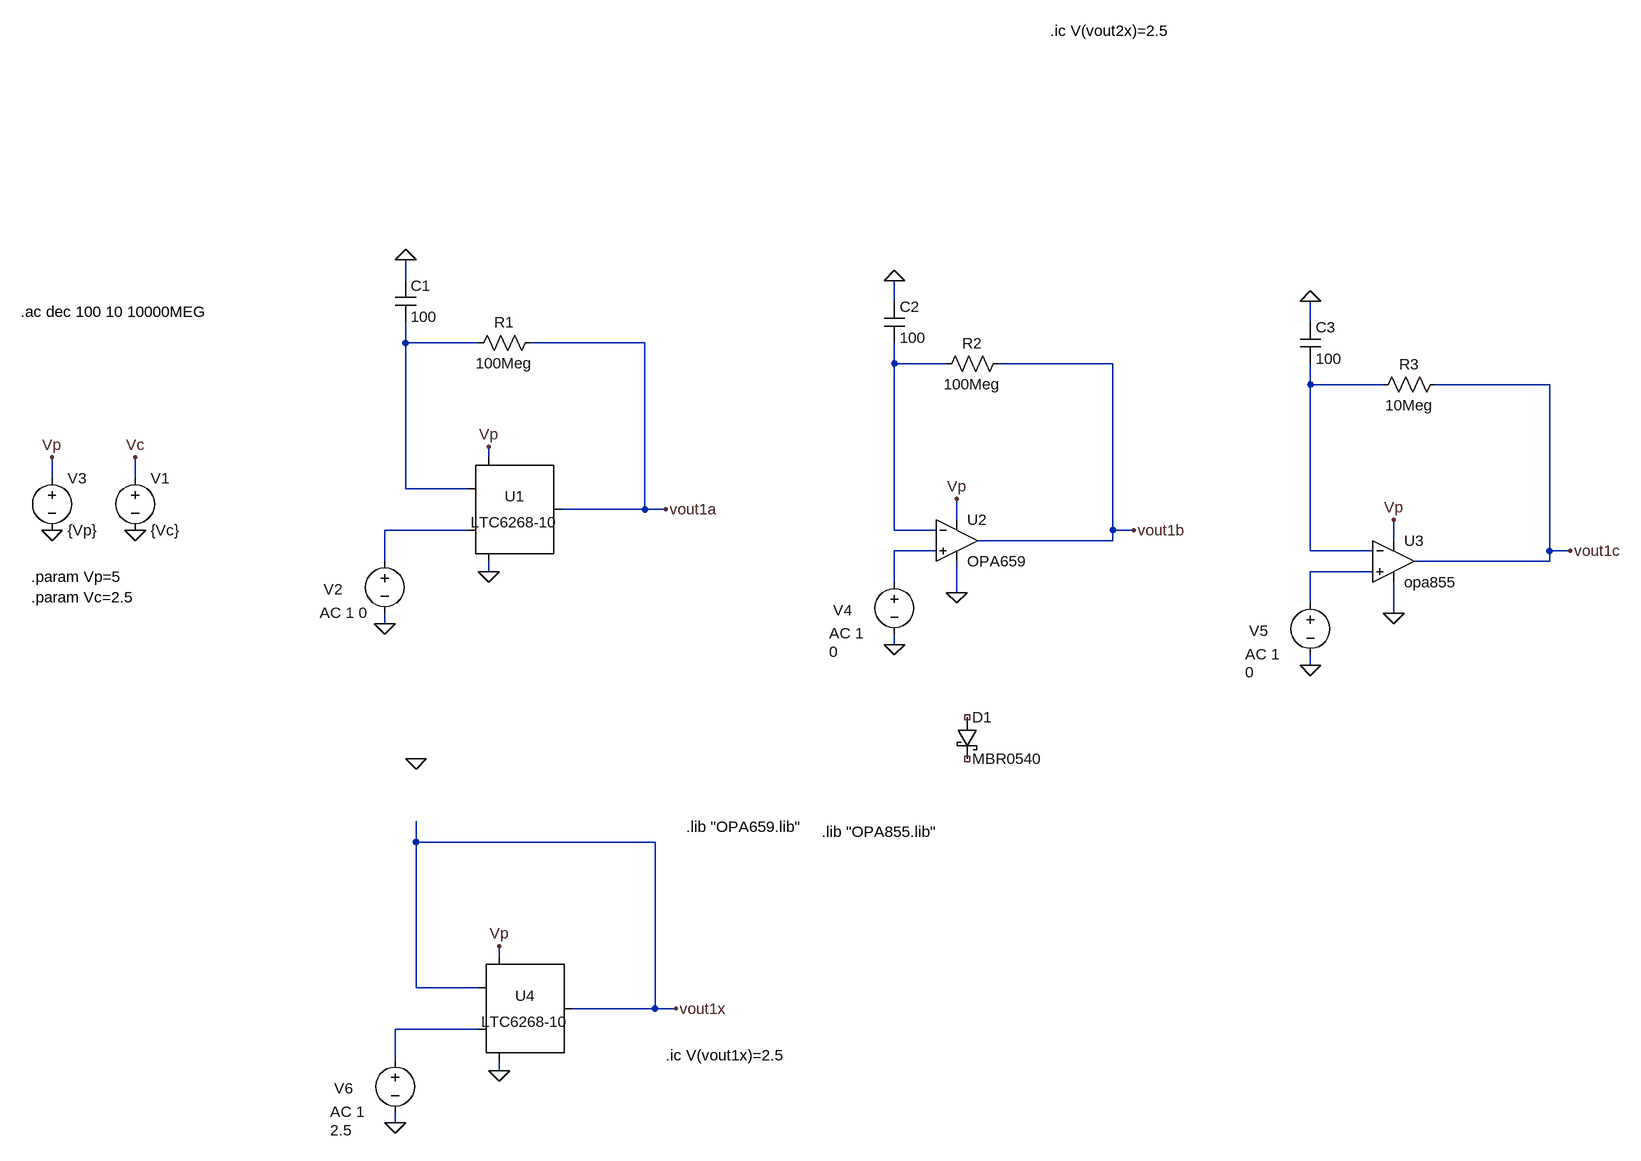
[diagram p0: schematic 3stagecompensator_localloopgainchecks_20220221 -1.asc]
3stagecompensator_localloopgainchecks_20220221 -1.asc, the LTspice schematic file:
Version 4
SHEET 1 6016 2820
WIRE -448 -304 -448 -336
WIRE 304 -272 304 -304
WIRE 944 -240 944 -272
WIRE -448 -208 -448 -240
WIRE -336 -208 -448 -208
WIRE -80 -208 -256 -208
WIRE 304 -176 304 -208
WIRE 384 -176 304 -176
WIRE 640 -176 464 -176
WIRE 944 -144 944 -176
WIRE 1056 -144 944 -144
WIRE 1312 -144 1136 -144
WIRE -320 -32 -320 -48
WIRE -992 0 -992 -32
WIRE -864 0 -864 -32
WIRE -448 16 -448 -208
WIRE -352 16 -448 16
WIRE -80 48 -80 -208
WIRE -80 48 -208 48
WIRE -48 48 -80 48
WIRE 400 64 400 32
WIRE -352 80 -480 80
WIRE 304 80 304 -176
WIRE 368 80 304 80
WIRE 640 80 640 -176
WIRE 672 80 640 80
WIRE 640 96 640 80
WIRE 640 96 432 96
WIRE 1072 96 1072 64
WIRE 368 112 304 112
WIRE 944 112 944 -144
WIRE 1040 112 944 112
WIRE 1312 112 1312 -144
WIRE 1344 112 1312 112
WIRE -480 128 -480 80
WIRE 1312 128 1312 112
WIRE 1312 128 1104 128
WIRE -320 144 -320 128
WIRE 1040 144 944 144
WIRE 304 160 304 112
WIRE 400 176 400 128
WIRE 944 192 944 144
WIRE 1072 208 1072 160
WIRE -480 224 -480 208
WIRE 304 256 304 240
WIRE 944 288 944 272
WIRE -432 560 -432 528
WIRE -64 560 -432 560
WIRE -304 736 -304 720
WIRE -432 784 -432 560
WIRE -336 784 -432 784
WIRE -64 816 -64 560
WIRE -64 816 -192 816
WIRE -32 816 -64 816
WIRE -336 848 -464 848
WIRE -464 896 -464 848
WIRE -304 912 -304 896
WIRE -464 992 -464 976
FLAG -320 144 0
FLAG -992 80 0
FLAG -48 48 vout1a
FLAG -992 -32 Vp
FLAG -864 80 0
FLAG -864 -32 Vc
FLAG -320 -48 Vp
FLAG -480 224 0
FLAG -448 -336 0
FLAG 400 176 0
FLAG 672 80 vout1b
FLAG 400 32 Vp
FLAG 304 256 0
FLAG 304 -304 0
FLAG 1072 208 0
FLAG 1344 112 vout1c
FLAG 1072 64 Vp
FLAG 944 288 0
FLAG 944 -272 0
FLAG -304 912 0
FLAG -32 816 vout1x
FLAG -304 720 Vp
FLAG -464 992 0
FLAG -432 432 0
SYMBOL Opamps\\LTC6268-10 -320 48 R0
SYMATTR InstName U1
SYMBOL voltage -992 -16 R0
WINDOW 123 0 0 Left 2
WINDOW 39 0 0 Left 2
SYMATTR InstName V3
SYMATTR Value {Vp}
SYMBOL voltage -864 -16 R0
WINDOW 123 0 0 Left 2
WINDOW 39 0 0 Left 2
SYMATTR InstName V1
SYMATTR Value {Vc}
SYMBOL voltage -480 112 R0
WINDOW 0 -94 59 Left 2
WINDOW 123 -100 95 Left 2
WINDOW 39 0 0 Left 0
WINDOW 3 -100 123 Left 2
SYMATTR InstName V2
SYMATTR Value2 AC 1 0
SYMATTR Value ""
SYMBOL res -240 -224 R90
WINDOW 0 0 56 VBottom 2
WINDOW 3 32 56 VTop 2
SYMATTR InstName R1
SYMATTR Value 100Meg
SYMBOL cap -464 -304 R0
SYMATTR InstName C1
SYMATTR Value 100
SYMBOL voltage 304 144 R0
WINDOW 0 -94 59 Left 2
WINDOW 123 -100 95 Left 2
WINDOW 39 0 0 Left 0
WINDOW 3 -100 123 Left 2
SYMATTR InstName V4
SYMATTR Value2 AC 1
SYMATTR Value 0
SYMBOL res 480 -192 R90
WINDOW 0 0 56 VBottom 2
WINDOW 3 32 56 VTop 2
SYMATTR InstName R2
SYMATTR Value 100Meg
SYMBOL cap 288 -272 R0
SYMATTR InstName C2
SYMATTR Value 100
SYMBOL voltage 944 176 R0
WINDOW 0 -94 59 Left 2
WINDOW 123 -100 95 Left 2
WINDOW 39 0 0 Left 0
WINDOW 3 -100 123 Left 2
SYMATTR InstName V5
SYMATTR Value2 AC 1
SYMATTR Value 0
SYMBOL res 1152 -160 R90
WINDOW 0 0 56 VBottom 2
WINDOW 3 32 56 VTop 2
SYMATTR InstName R3
SYMATTR Value 10Meg
SYMBOL cap 928 -240 R0
SYMATTR InstName C3
SYMATTR Value 100
SYMBOL OPA659 400 32 R0
SYMATTR InstName U2
SYMBOL opa855 1072 64 R0
SYMATTR InstName U3
SYMBOL Opamps\\LTC6268-10 -304 816 R0
SYMATTR InstName U4
SYMBOL voltage -464 880 R0
WINDOW 0 -94 59 Left 2
WINDOW 123 -100 95 Left 2
WINDOW 39 0 0 Left 0
WINDOW 3 -100 123 Left 2
SYMATTR InstName V6
SYMATTR Value2 AC 1
SYMATTR Value 2.5
SYMBOL schottky 400 368 R0
SYMATTR InstName D1
SYMATTR Value MBR0540
SYMATTR Description Diode
SYMATTR Type diode
TEXT -1040 -256 Left 2 !.ac dec 100 10 10000MEG
TEXT -1024 152 Left 2 !.param Vp=5\n.param Vc=2.5
TEXT 544 -688 Left 2 !.ic V(vout2x)=2.5
TEXT 192 544 Left 2 !.lib "OPA855.lib"
TEXT -16 536 Left 2 !.lib "OPA659.lib"
TEXT -48 888 Left 2 !.ic V(vout1x)=2.5

The netlist it stands for:
* 3stagecompensator_localloopgainchecks_20220221 -1.asc
XU1 N004 N001 vout1a Vp 0 NC_01 LTC6268-10
V3 Vp 0 {Vp}
V1 Vc 0 {Vc}
V2 N004 0 AC 1 0
R1 vout1a N001 100Meg
C1 0 N001 100
V4 N005 0 0 AC 1
R2 vout1b N002 100Meg
C2 0 N002 100
V5 N006 0 0 AC 1
R3 vout1c N003 10Meg
C3 0 N003 100
* U2: OPA659 (symbol OPA659 not available, pins judged from their places): In+=N005 In-=N002 V+=Vp V-=0 OUT=vout1b
* U3: opa855 (symbol opa855 not available, pins judged from their places): In+=N006 In-=N003 V+=Vp V-=0 OUT=vout1c
XU4 N007 vout1x vout1x Vp 0 NC_02 LTC6268-10
V6 N007 0 2.5 AC 1
D1 NC_03 NC_04 MBR0540
.model D D
.lib standard.dio
.ac dec 100 10 10000MEG
.param Vp=5
.param Vc=2.5
.ic V(vout2x)=2.5
.lib "OPA855.lib"
.lib "OPA659.lib"
.ic V(vout1x)=2.5
.lib LTC2.lib
.backanno
.end